# Altium project Elkapod_power_supply.PrjPcb (part 1 of 6)
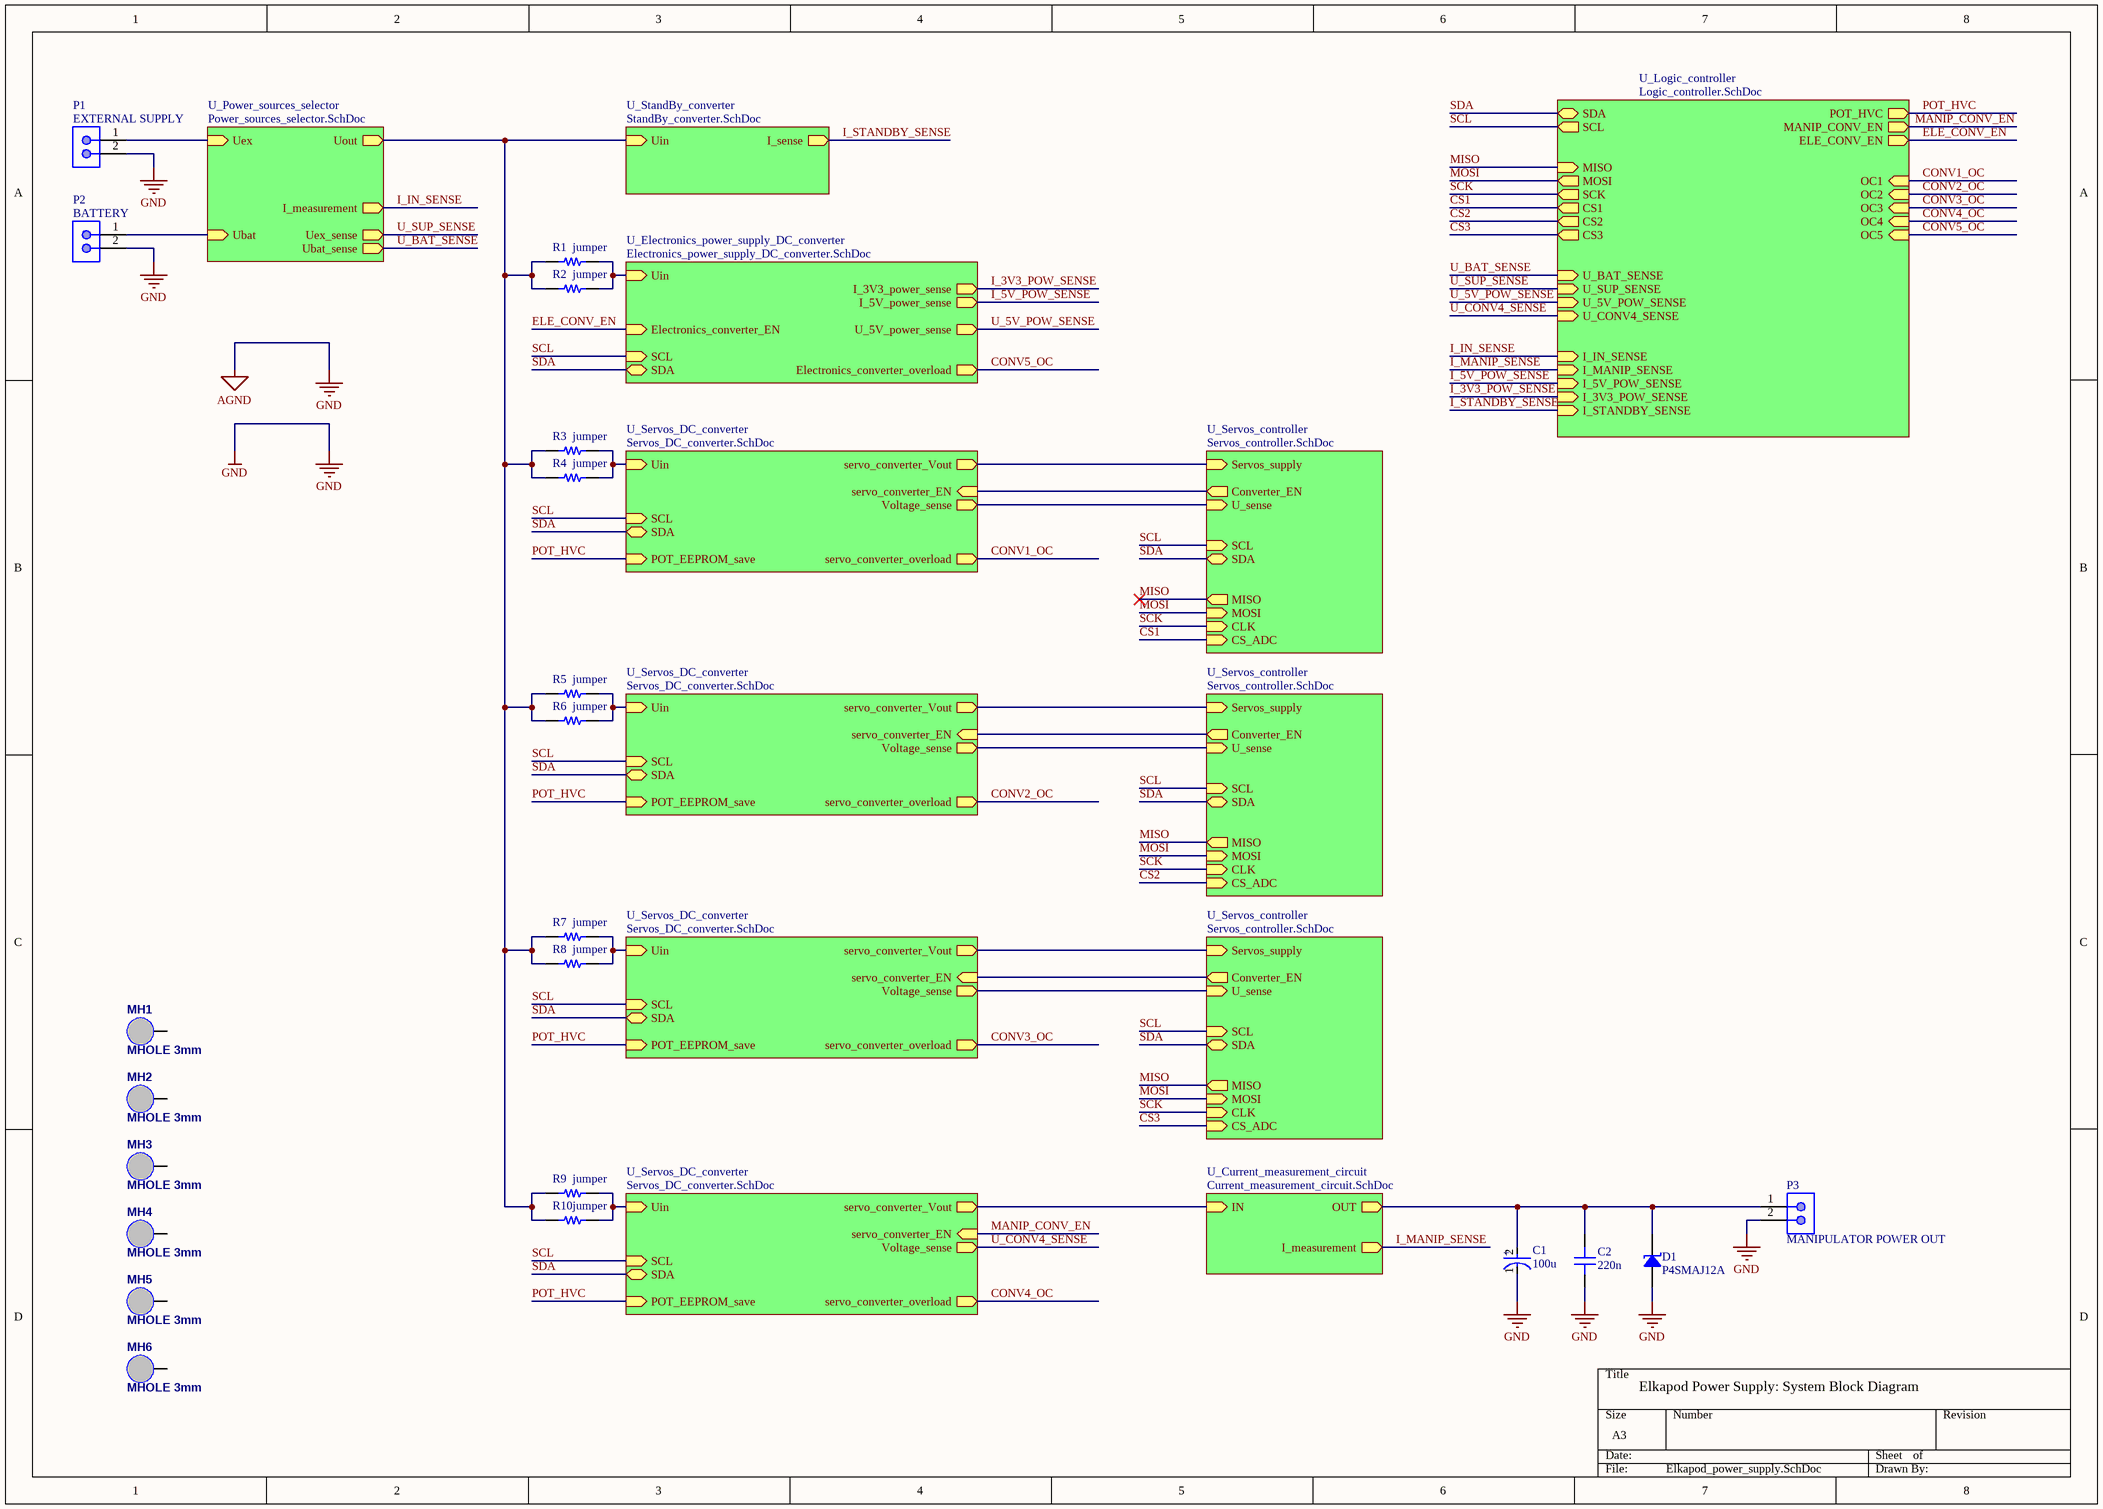
[diagram p0: Elkapod_power_supply.SchDoc]
10 sheets, 1021 parts. Net scope: hierarchical (ports join the sheet entries above them; power ports are global).
Board file: Elkapod_power_supply_PCB.PcbDoc
Sheets:
  Elkapod_power_supply.SchDoc
    U_Power_sources_selector = Power_sources_selector.SchDoc
      U_Current_measurement_circuit = Current_measurement_circuit.SchDoc
    U_StandBy_converter = StandBy_converter.SchDoc
      U_Current_measurement_circuit? = Current_measurement_circuit.SchDoc
    U_Servos_controller = Servos_controller.SchDoc
      U_Servo_control_module? = Servo_control_module.SchDoc
        U_Current_measurement_circuit? = Current_measurement_circuit.SchDoc
      U_Servo_control_module? = Servo_control_module.SchDoc
        U_Current_measurement_circuit? = Current_measurement_circuit.SchDoc
      U_Servo_control_module? = Servo_control_module.SchDoc
        U_Current_measurement_circuit? = Current_measurement_circuit.SchDoc
      U_Servo_control_module? = Servo_control_module.SchDoc
        U_Current_measurement_circuit? = Current_measurement_circuit.SchDoc
      U_Servo_control_module? = Servo_control_module.SchDoc
        U_Current_measurement_circuit? = Current_measurement_circuit.SchDoc
      U_Servo_control_module? = Servo_control_module.SchDoc
        U_Current_measurement_circuit? = Current_measurement_circuit.SchDoc
    U_Servos_DC_converter = Servos_DC_converter.SchDoc
    U_Electronics_power_supply_DC_converter = Electronics_power_supply_DC_converter.SchDoc
      U_Current_measurement_circuit = Current_measurement_circuit.SchDoc
      U_Current_measurement_circuit = Current_measurement_circuit.SchDoc
      U_Controllable_voltage_outputs = Controllable_voltage_outputs.SchDoc
    U_Current_measurement_circuit = Current_measurement_circuit.SchDoc
    U_Servos_controller = Servos_controller.SchDoc
      U_Servo_control_module? = Servo_control_module.SchDoc
        U_Current_measurement_circuit? = Current_measurement_circuit.SchDoc
      U_Servo_control_module? = Servo_control_module.SchDoc
        U_Current_measurement_circuit? = Current_measurement_circuit.SchDoc
      U_Servo_control_module? = Servo_control_module.SchDoc
        U_Current_measurement_circuit? = Current_measurement_circuit.SchDoc
      U_Servo_control_module? = Servo_control_module.SchDoc
        U_Current_measurement_circuit? = Current_measurement_circuit.SchDoc
      U_Servo_control_module? = Servo_control_module.SchDoc
        U_Current_measurement_circuit? = Current_measurement_circuit.SchDoc
      U_Servo_control_module? = Servo_control_module.SchDoc
        U_Current_measurement_circuit? = Current_measurement_circuit.SchDoc
    U_Servos_controller = Servos_controller.SchDoc
      U_Servo_control_module? = Servo_control_module.SchDoc
        U_Current_measurement_circuit? = Current_measurement_circuit.SchDoc
      U_Servo_control_module? = Servo_control_module.SchDoc
        U_Current_measurement_circuit? = Current_measurement_circuit.SchDoc
      U_Servo_control_module? = Servo_control_module.SchDoc
        U_Current_measurement_circuit? = Current_measurement_circuit.SchDoc
      U_Servo_control_module? = Servo_control_module.SchDoc
        U_Current_measurement_circuit? = Current_measurement_circuit.SchDoc
      U_Servo_control_module? = Servo_control_module.SchDoc
        U_Current_measurement_circuit? = Current_measurement_circuit.SchDoc
      U_Servo_control_module? = Servo_control_module.SchDoc
        U_Current_measurement_circuit? = Current_measurement_circuit.SchDoc
    U_Servos_DC_converter = Servos_DC_converter.SchDoc
    U_Servos_DC_converter = Servos_DC_converter.SchDoc
    U_Servos_DC_converter = Servos_DC_converter.SchDoc
    U_Logic_controller = Logic_controller.SchDoc

## Sheet Elkapod_power_supply.SchDoc: Elkapod Power Supply Block Diagram
size A3; SheetNumber: 1; SheetTotal: 10

### Parts
C1  100u  [FP-FKE-MFG]
C2  220n  [CAP 0603_1608]
D1  P4SMAJ12A  [DO214AC SMA]
MH1  MHOLE 3mm  [3mm screw drill III]  (no BOM)
MH2  MHOLE 3mm  [3mm screw drill III]  (no BOM)
MH3  MHOLE 3mm  [3mm screw drill III]  (no BOM)
MH4  MHOLE 3mm  [3mm screw drill III]  (no BOM)
MH5  MHOLE 3mm  [3mm screw drill III]  (no BOM)
MH6  MHOLE 3mm  [3mm screw drill III]  (no BOM)
P1  EXTERNAL SUPPLY  [XT60PW-M]
P2  BATTERY  [XT60PW-M]
P3  MANIPULATOR POWER OUT  [XT60PW-M]
R1  jumper  [STACKPOLE CSM2512]
R2  jumper  [STACKPOLE CSM2512]
R3  jumper  [STACKPOLE CSM2512]
R4  jumper  [STACKPOLE CSM2512]
R5  jumper  [STACKPOLE CSM2512]
R6  jumper  [STACKPOLE CSM2512]
R7  jumper  [STACKPOLE CSM2512]
R8  jumper  [STACKPOLE CSM2512]
R9  jumper  [STACKPOLE CSM2512]
R10  jumper  [STACKPOLE CSM2512]

### Sub-sheets
U_Current_measurement_circuit = Current_measurement_circuit.SchDoc: I_measurement (out), IN (in), OUT (out)  | Rsense_value: 1m
U_Electronics_power_supply_DC_converter = Electronics_power_supply_DC_converter.SchDoc: Uin (in), Electronics_converter_EN (in), Electronics_converter_overload (out), I_3V3_power_sense (out), I_5V_power_sense (out), U_5V_power_sense (out), SCL (in), SDA (bidir)
U_Logic_controller = Logic_controller.SchDoc: POT_HVC (out), MANIP_CONV_EN (out), ELE_CONV_EN (out), MOSI (out), MISO (in), SCK (out), SDA (bidir), SCL (out), I_IN_SENSE (in), I_5V_POW_SENSE (in), I_3V3_POW_SENSE (in), I_MANIP_SENSE (in), I_STANDBY_SENSE (in), U_BAT_SENSE (in), U_SUP_SENSE (in), U_CONV4_SENSE (in), U_5V_POW_SENSE (in), CS3 (out), CS2 (out), CS1 (out), OC1 (in), OC2 (in), OC3 (in), OC4 (in), OC5 (in)
U_Power_sources_selector = Power_sources_selector.SchDoc: Ubat (in), Uout (out), I_measurement (out), Uex (in), Uex_sense (out), Ubat_sense (out)
U_Servos_controller = Servos_controller.SchDoc: CS_ADC (in), Servos_supply (in), Converter_EN (out), U_sense (in), SCL (in), SDA (bidir), MOSI (in), CLK (in), MISO (out)
U_Servos_controller = Servos_controller.SchDoc: CS_ADC (in), Servos_supply (in), Converter_EN (out), U_sense (in), SCL (in), SDA (bidir), MOSI (in), CLK (in), MISO (out)
U_Servos_controller = Servos_controller.SchDoc: CS_ADC (in), Servos_supply (in), Converter_EN (out), U_sense (in), SCL (in), SDA (bidir), MOSI (in), CLK (in), MISO (out)
U_Servos_DC_converter = Servos_DC_converter.SchDoc: Uin (in), servo_converter_EN (in), servo_converter_overload (out), servo_converter_Vout (out), POT_EEPROM_save (in), Voltage_sense (out), SDA (bidir), SCL (in)  | RF2_value: 2,7k; RF1_value: 1k; RF3_value: 910
U_Servos_DC_converter = Servos_DC_converter.SchDoc: Uin (in), servo_converter_EN (in), servo_converter_overload (out), servo_converter_Vout (out), POT_EEPROM_save (in), Voltage_sense (out), SDA (bidir), SCL (in)  | RF2_value: 2,7k; RF1_value: 1k; RF3_value: 910
U_Servos_DC_converter = Servos_DC_converter.SchDoc: Uin (in), servo_converter_EN (in), servo_converter_overload (out), servo_converter_Vout (out), POT_EEPROM_save (in), Voltage_sense (out), SDA (bidir), SCL (in)  | RF2_value: 2,7k; RF1_value: 1k; RF3_value: 910
U_Servos_DC_converter = Servos_DC_converter.SchDoc: Uin (in), servo_converter_EN (in), servo_converter_overload (out), servo_converter_Vout (out), POT_EEPROM_save (in), Voltage_sense (out), SDA (bidir), SCL (in)  | RF2_value: 2,7k; RF1_value: 1k; RF3_value: 910
U_StandBy_converter = StandBy_converter.SchDoc: Uin (in), I_sense (out)

### Nets
AGND: C1.1(C) C2.2 D1.1 P1.2(-) P2.2(-) P3.2(-)  [also labelled GND]
CONV1_OC: sheet U_Servos_DC_converter/servo_converter_overload, sheet U_Logic_controller/OC1
CONV2_OC: sheet U_Servos_DC_converter/servo_converter_overload, sheet U_Logic_controller/OC2
CONV3_OC: sheet U_Servos_DC_converter/servo_converter_overload, sheet U_Logic_controller/OC3
CONV4_OC: sheet U_Servos_DC_converter/servo_converter_overload, sheet U_Logic_controller/OC4
CONV5_OC: sheet U_Electronics_power_supply_DC_converter/Electronics_converter_overload, sheet U_Logic_controller/OC5
CS1: sheet U_Servos_controller/CS_ADC, sheet U_Logic_controller/CS1
CS2: sheet U_Servos_controller/CS_ADC, sheet U_Logic_controller/CS2
CS3: sheet U_Servos_controller/CS_ADC, sheet U_Logic_controller/CS3
ELE_CONV_EN: sheet U_Electronics_power_supply_DC_converter/Electronics_converter_EN, sheet U_Logic_controller/ELE_CONV_EN
I_3V3_POW_SENSE: sheet U_Electronics_power_supply_DC_converter/I_3V3_power_sense, sheet U_Logic_controller/I_3V3_POW_SENSE
I_5V_POW_SENSE: sheet U_Electronics_power_supply_DC_converter/I_5V_power_sense, sheet U_Logic_controller/I_5V_POW_SENSE
I_IN_SENSE: sheet U_Power_sources_selector/I_measurement, sheet U_Logic_controller/I_IN_SENSE
I_MANIP_SENSE: sheet U_Current_measurement_circuit/I_measurement, sheet U_Logic_controller/I_MANIP_SENSE
I_STANDBY_SENSE: sheet U_StandBy_converter/I_sense, sheet U_Logic_controller/I_STANDBY_SENSE
MANIP_CONV_EN: sheet U_Servos_DC_converter/servo_converter_EN, sheet U_Logic_controller/MANIP_CONV_EN
MISO: sheet U_Servos_controller/MISO, sheet U_Servos_controller/MISO, sheet U_Servos_controller/MISO, sheet U_Logic_controller/MISO
MOSI: sheet U_Servos_controller/MOSI, sheet U_Servos_controller/MOSI, sheet U_Servos_controller/MOSI, sheet U_Logic_controller/MOSI
POT_HVC: sheet U_Servos_DC_converter/POT_EEPROM_save, sheet U_Servos_DC_converter/POT_EEPROM_save, sheet U_Servos_DC_converter/POT_EEPROM_save, sheet U_Servos_DC_converter/POT_EEPROM_save, sheet U_Logic_controller/POT_HVC
SCK: sheet U_Servos_controller/CLK, sheet U_Servos_controller/CLK, sheet U_Servos_controller/CLK, sheet U_Logic_controller/SCK
SCL: sheet U_Servos_controller/SCL, sheet U_Servos_DC_converter/SCL, sheet U_Electronics_power_supply_DC_converter/SCL, sheet U_Servos_controller/SCL, sheet U_Servos_controller/SCL, sheet U_Servos_DC_converter/SCL, sheet U_Servos_DC_converter/SCL, sheet U_Servos_DC_converter/SCL, sheet U_Logic_controller/SCL
SDA: sheet U_Servos_controller/SDA, sheet U_Servos_DC_converter/SDA, sheet U_Electronics_power_supply_DC_converter/SDA, sheet U_Servos_controller/SDA, sheet U_Servos_controller/SDA, sheet U_Servos_DC_converter/SDA, sheet U_Servos_DC_converter/SDA, sheet U_Servos_DC_converter/SDA, sheet U_Logic_controller/SDA
servo_converter_Vout: sheet U_Servos_controller/Servos_supply, sheet U_Servos_DC_converter/servo_converter_Vout
servo_converter_Vout: sheet U_Current_measurement_circuit/IN, sheet U_Servos_DC_converter/servo_converter_Vout  [a separate net that carries the same name]
servo_converter_Vout: sheet U_Servos_controller/Servos_supply, sheet U_Servos_DC_converter/servo_converter_Vout  [a separate net that carries the same name]
servo_converter_Vout: sheet U_Servos_controller/Servos_supply, sheet U_Servos_DC_converter/servo_converter_Vout  [a separate net that carries the same name]
U_5V_POW_SENSE: sheet U_Electronics_power_supply_DC_converter/U_5V_power_sense, sheet U_Logic_controller/U_5V_POW_SENSE
U_BAT_SENSE: sheet U_Power_sources_selector/Ubat_sense, sheet U_Logic_controller/U_BAT_SENSE
U_CONV4_SENSE: sheet U_Servos_DC_converter/Voltage_sense, sheet U_Logic_controller/U_CONV4_SENSE
U_sup: R1.2 R2.2 R3.2 R4.2 R5.2 R6.2 R7.2 R8.2 R9.2 R10.2 ; sheet U_Power_sources_selector/Uout, sheet U_StandBy_converter/Uin
U_SUP_SENSE: sheet U_Power_sources_selector/Uex_sense, sheet U_Logic_controller/U_SUP_SENSE
Uin: R1.1 R2.1 ; sheet U_Electronics_power_supply_DC_converter/Uin
Uin: R3.1 R4.1 ; sheet U_Servos_DC_converter/Uin  [a separate net that carries the same name]
Uin: R5.1 R6.1 ; sheet U_Servos_DC_converter/Uin  [a separate net that carries the same name]
Uin: R7.1 R8.1 ; sheet U_Servos_DC_converter/Uin  [a separate net that carries the same name]
Uin: R9.1 R10.1 ; sheet U_Servos_DC_converter/Uin  [a separate net that carries the same name]
NetC1_2: C1.2(A) C2.1 D1.2 P3.1(+) ; sheet U_Current_measurement_circuit/OUT
NetC72_1#2_2: sheet U_Servos_controller/U_sense, sheet U_Servos_DC_converter/Voltage_sense
NetC72_2#2_2: sheet U_Servos_controller/U_sense, sheet U_Servos_DC_converter/Voltage_sense
NetC72_3#2_2: sheet U_Servos_controller/U_sense, sheet U_Servos_DC_converter/Voltage_sense
NetF1_1: P1.1(+) ; sheet U_Power_sources_selector/Uex
NetF2_1: P2.1(+) ; sheet U_Power_sources_selector/Ubat
NetR39_1_1: sheet U_Servos_controller/Converter_EN, sheet U_Servos_DC_converter/servo_converter_EN
NetR39_2_1: sheet U_Servos_controller/Converter_EN, sheet U_Servos_DC_converter/servo_converter_EN
NetR39_3_1: sheet U_Servos_controller/Converter_EN, sheet U_Servos_DC_converter/servo_converter_EN

Not connected (* = marked no-connect by the designer): MH1 1(GND); MH2 1(GND); MH3 1(GND); MH4 1(GND); MH5 1(GND); MH6 1(GND)

### Notes on the sheet
- Elkapod Power Supply: System Block Diagram
- (in symbol CMP-2000-06205-2) +

### Library data of the parts
C1 = CMP-2000-06205-2: CAP ALUM 100UF 20% 25V SMD; Ripple Current (AC): 300mA; Leakage Current: 3uA; Dielectric Material: Aluminium; Impedance: 260mR; Life (Hours): 2000Hour; Max Operating Temperature: 105°C; Voltage Rating (DC): 25V; Packaging: Tape and Reel; Min Operating Temperature: -55°C; Capacitance: 100uF; Ripple Current: 300mA; Mount: Surface Mount; Lead Free: Lead Free; Construction: Cylindrical; Voltage Rating: 25V; RoHS Compliant: Yes; Case/Package: Radial; Height: 6.2mm; Tolerance: 20%; Diameter: 8mm; Termination: SMD/SMT; Package Quantity: 1; Width: 8.3mm; REACH SVHC: No SVHC; Series: FK; Number of Pins: 2; Voltage: 25V; Radiation Hardening: No; Height - Seated (Max): 0.244inch; Length: 6.2mm; ESR (Equivalent Series Resistance): 260mR
C2 = C0603C272F3GAC7867: CAP CER 220nF 25V X5R 0603; manufacturer: KEMET; Temperature Coefficient: C0G, NP0; Tolerance: ±1%; Part Number: C0603C272F3GAC7867; Value: 220n; Applications: General Purpose; Capacitance: 220n; componentlink1description: Datasheet; componentlink1url: https://api.kemet.com/component-edge/download/datasheet/C0603C272F3GACTU.pdf; componentlink2description: DigiKey Link; componentlink2url: https://www.digikey.com/en/products/detail/kemet/C0603C272F3GAC7867/2200413; Device Package: 0603 (1608 Metric); Features: Low ESL; lastupdated: 09.02.2024 20:10:30; Lifecycle Status: Active; Minimum Order: 1; Mounting Type: Surface Mount, MLCC; Operating Temperature: -55°C ~ 125°C; Package / Case: 0603 (1608 Metric); packaging: TapeAndReel; partid: 2138; Part Status: Active; price: 0.40; series: SMD Comm C0G; Size / Dimension: 0.063" L x 0.031" W (1.60mm x 0.80mm); Thickness (Max): 0.034" (0.87mm); Voltage - Rated: 25V
D1 = SMA6J18A-TP: TVS DIODE 12VDC DO214AC; Part Number: P4SMAJ9.0A
MH1-MH6 = MHOLE_3MM: 3mm Mounting Hole
P1-P3 = XT60PW-M: XT60PW-M; 30A/500V angled female DC PCB socket (pin1 -> +, pin2 -> -)
R1-R10 = CSM2512FT20L0: RES 0 OHM 1W 2512; manufacturer: Stackpole Electronics Inc; Power (Watts): 3W; Temperature Coefficient: ±50ppm/°C; Tolerance: ±1%; value: 20 mOhms; Part Number: CSM2512FT20L0; componentlink1description: Datasheet; componentlink1url: https://www.seielect.com/Catalog/SEI-CSM.PDF; componentlink2description: DigiKey Link; componentlink2url: https://www.digikey.com/en/products/detail/stackpole-electronics-inc/CSM2512FT20L0/6270239; Composition: Metal Element; Device Package: 2512 (6332 Metric); Features: Current Sense; Height - Seated (Max): 0.035" (0.90mm); lastupdated: 03.06.2024 20:27:03; Lifecycle Status: Active; Minimum Order: 4000; Number of Terminations: 2; Operating Temperature: -55°C ~ 170°C; Package / Case: 2512 (6332 Metric); packaging: TapeAndReel; Part Status: Active; price: 0.19; Resistance: jumper; series: CSM; Size / Dimension: 0.252" L x 0.126" W (6.40mm x 3.20mm); Supplier Device Package: 2512

## Sheet Power_sources_selector.SchDoc
size A4; SheetNumber: 6; SheetTotal: 10
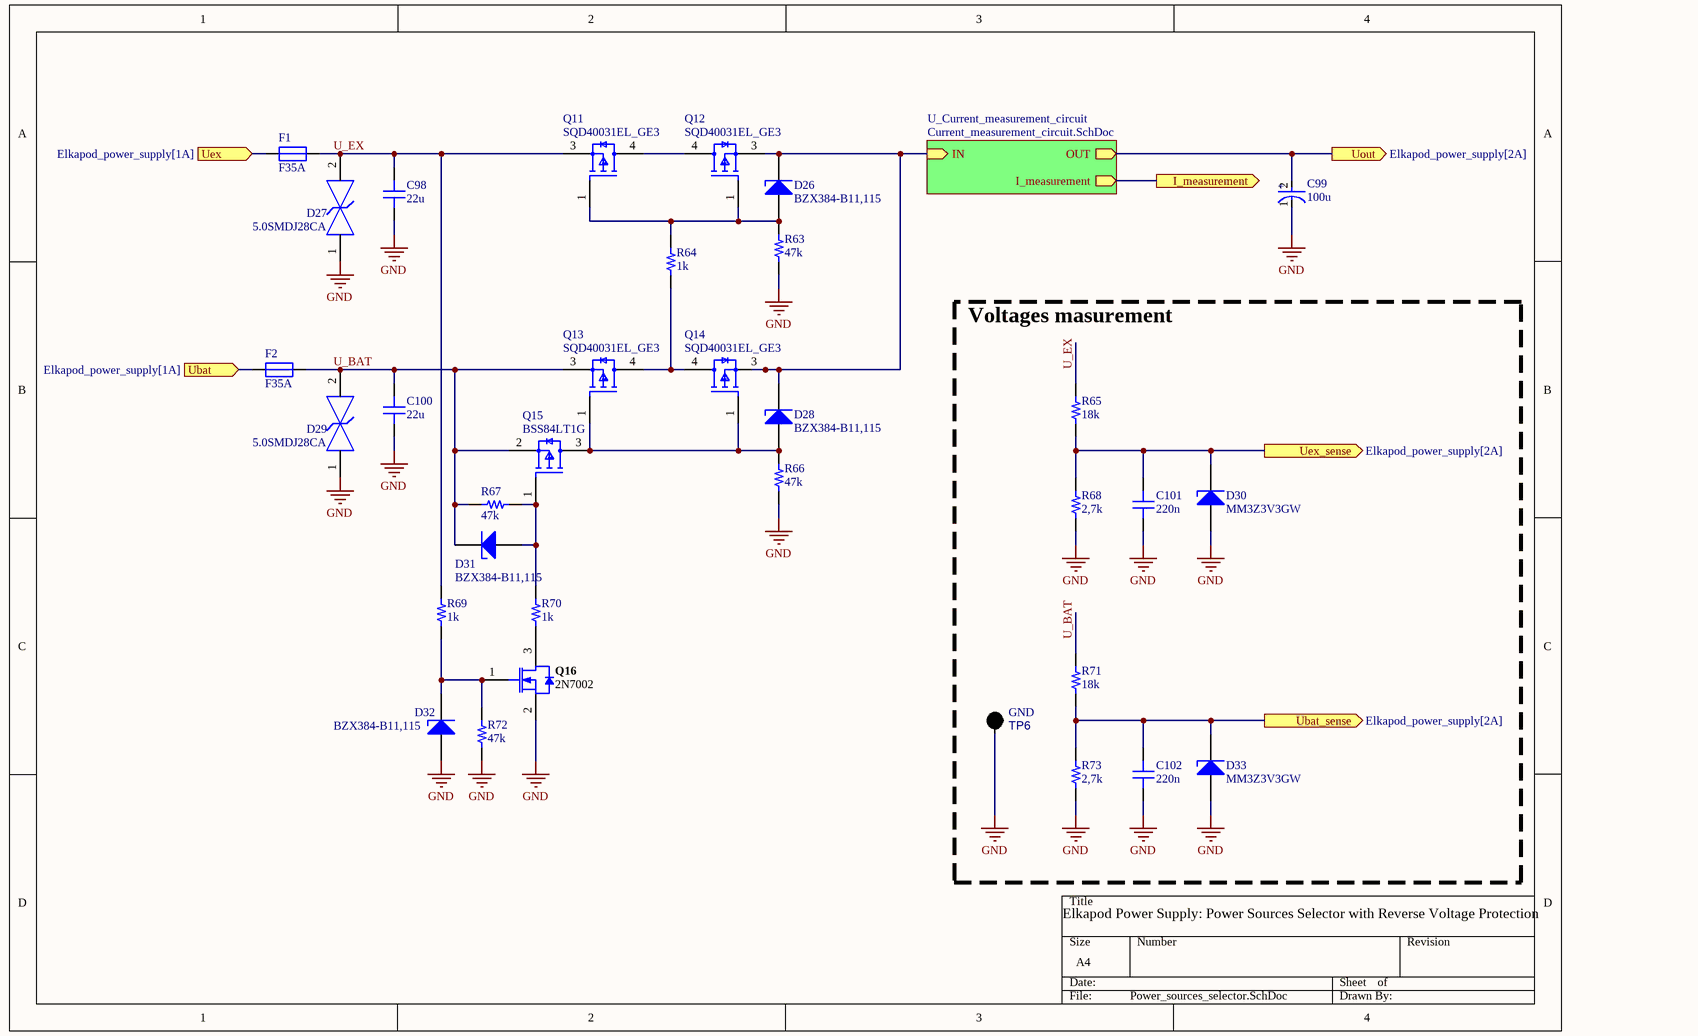
[diagram p1: Power_sources_selector.SchDoc]

### Parts
(Parts that share a designator on the sheet are numbered #1, #2 ... from top to bottom, then left to right.)
C98  22u  [CAP 0805_2012]
C99  100u  [FP-FKE-MFG]
C100  22u  [CAP 0805_2012]
C101#1  220n  [CAP 0603_1608]
C102#1  220n  [CAP 0603_1608]
D26  BZX384-B11,115  [SOD323]
D27  5.0SMDJ28CA  [FP-5_0SMDJ-CA-MFG]
D28  BZX384-B11,115  [SOD323]
D29  5.0SMDJ28CA  [FP-5_0SMDJ-CA-MFG]
D30  MM3Z3V3GW  [SOD323]
D31  BZX384-B11,115  [SOD323]
D32  BZX384-B11,115  [SOD323]
D33  MM3Z3V3GW  [SOD323]
F1  F35A  [6,3x32_fuse_PCB]
F2  F35A  [6,3x32_fuse_PCB]
Q11  SQD40031EL_GE3  [FP-T13-0592-MFG]
Q12  SQD40031EL_GE3  [FP-T13-0592-MFG]
Q13  SQD40031EL_GE3  [FP-T13-0592-MFG]
Q14  SQD40031EL_GE3  [FP-T13-0592-MFG]
Q15  BSS84LT1G  [FP-318-08-IPC_A]
Q16#1  2N7002  [INF-PG-SOT23_M]
R63  47k  [RES 0603_1608]
R64  1k  [RES 0603_1608]
R65  18k  [RES 0603_1608]
R66  47k  [RES 0603_1608]
R67#1  47k  [RES 0603_1608]
R68#1  2,7k  [RES 0603_1608]
R69#1  1k  [RES 0603_1608]
R70#1  1k  [RES 0603_1608]
R71#1  18k  [RES 0603_1608]
R72#1  47k  [RES 0603_1608]
R73#1  2,7k  [RES 0603_1608]
TP6  GND  [Keystone_5006_BLACK]

### Blocks framed on the sheet
Voltages masurement: C101#1 C102#1 D30 D33 R65 R68#1 R71#1 R73#1 TP6

### Sub-sheets
U_Current_measurement_circuit = Current_measurement_circuit.SchDoc: I_measurement (out), IN (in), OUT (out)  | Rsense_value: 0,5m

### Ports
I_measurement (out, see Elkapod_power_supply[2A], Current_measurement_circuit[3B]), Ubat (in, see Elkapod_power_supply[1A]), Ubat_sense (out, see Elkapod_power_supply[2A]), Uex (in, see Elkapod_power_supply[1A]), Uex_sense (out, see Elkapod_power_supply[2A]), Uout (out, see Elkapod_power_supply[2A])

### Nets
GND: C98.1 C99.1(C) C100.1 C101#1.1 C102#1.1 D27.1 D29.1 D30.1(A) D32.1(A) D33.1(A) Q16#1.2(SOURCE) R63.1 R66.1 R68#1.2 R72#1.1 R73#1.2 TP6.0  [project net AGND]
I_IN_SENSE: port I_measurement, sheet U_Current_measurement_circuit/I_measurement
U_BAT: C100.2 D29.2 D31.2(K) F2.2 Q13.3(S) Q15.2(S) R67#1.2 R71#1.1  [project net U_BAT_6]
U_BAT_SENSE: C102#1.2 D33.2(K) R71#1.2 R73#1.1 ; port Ubat_sense
U_EX: C98.2 D27.2 F1.2 Q11.3(S) R65.1 R69#1.2  [project net U_EX_6]
U_sup: C99.2(A) ; port Uout, sheet U_Current_measurement_circuit/OUT
U_SUP_SENSE: C101#1.2 D30.2(K) R65.2 R68#1.1 ; port Uex_sense
NetD26_1: D26.1(A) Q11.1(G) Q12.1(G) R63.2 R64.2
NetD26_2: D26.2(K) D28.2(K) Q12.3(S) Q14.3(S) ; sheet U_Current_measurement_circuit/IN
NetD28_1: D28.1(A) Q13.1(G) Q14.1(G) Q15.3(D) R66.2
NetD31_1: D31.1(A) Q15.1(G) R67#1.1 R70#1.2
NetD32_2: D32.2(K) Q16#1.1(GATE) R69#1.1 R72#1.2
NetF1_1: F1.1 ; port Uex
NetF2_1: F2.1 ; port Ubat
NetQ11_4: Q11.4(D) Q12.4(D)
NetQ13_4: Q13.4(D) Q14.4(D) R64.1
NetQ16#1_3: Q16#1.3(DRAIN) R70#1.1

### Notes on the sheet
- Elkapod Power Supply: Power Sources Selector with Reverse Voltage Protection
- (in symbol CMP-2000-06205-2) +

### Library data of the parts
C98 C100 = VJ0805Y684KXQTW1BC: CAP CER 22UF 25V X7R 0805; manufacturer: Vishay Vitramon; Tolerance: ±10%; Voltage - Rated: 10V; Part Number: VJ0805Y684KXQTW1BC; Value: 22u; Applications: General Purpose; Capacitance: 22u; componentlink1description: Datasheet; componentlink1url: https://www.vishay.com/docs/28548/vjw1bcbascomseries.pdf; componentlink2description: DigiKey Link; componentlink2url: https://www.digikey.com/en/products/detail/vishay-vitramon/VJ0805Y684KXQTW1BC/8313569; Device Package: 0805 (2012 Metric); lastupdated: 09.02.2024 20:13:13; Lifecycle Status: Active; Minimum Order: 1; Mounting Type: Surface Mount, MLCC; Operating Temperature: -55°C ~ 125°C; Package / Case: 0805 (2012 Metric); packaging: TapeAndReel; partid: 57262; price: 0.05; series: VJ W1BC; Size / Dimension: 0.079" L x 0.049" W (2.00mm x 1.25mm); Temperature Coefficient: X7R; Thickness (Max): 0.053" (1.35mm)
C99 = CMP-2000-06205-2: as C1 on sheet Elkapod_power_supply; Max Operating Temperature: 105°C; Voltage Rating (DC): 25V; Packaging: Tape and Reel; Min Operating Temperature: -55°C; Capacitance: 100uF; Ripple Current: 300mA; Mount: Surface Mount; Lead Free: Lead Free; Construction: Cylindrical; Voltage Rating: 25V; RoHS Compliant: Yes; Case/Package: Radial; Height: 6.2mm; Tolerance: 20%; Diameter: 8mm; Termination: SMD/SMT; Package Quantity: 1; Width: 8.3mm; REACH SVHC: No SVHC; Series: FK; Number of Pins: 2; Voltage: 25V; Radiation Hardening: No; Height - Seated (Max): 0.244inch; Length: 6.2mm; ESR (Equivalent Series Resistance): 260mR
C101#1 C102#1 = C0603C272F3GAC7867: as C2 on sheet Elkapod_power_supply; Part Number: C0603C272F3GAC7867; Value: 220n; Applications: General Purpose; Capacitance: 220n; componentlink1description: Datasheet; componentlink1url: https://api.kemet.com/component-edge/download/datasheet/C0603C272F3GACTU.pdf; componentlink2description: DigiKey Link; componentlink2url: https://www.digikey.com/en/products/detail/kemet/C0603C272F3GAC7867/2200413; Device Package: 0603 (1608 Metric); Features: Low ESL; lastupdated: 09.02.2024 20:10:30; Lifecycle Status: Active; Minimum Order: 1; Mounting Type: Surface Mount, MLCC; Operating Temperature: -55°C ~ 125°C; Package / Case: 0603 (1608 Metric); packaging: TapeAndReel; partid: 2138; Part Status: Active; price: 0.40; series: SMD Comm C0G; Size / Dimension: 0.063" L x 0.031" W (1.60mm x 0.80mm); Thickness (Max): 0.034" (0.87mm); Voltage - Rated: 25V
D26 D28 D31 D32 = Zener_Diode_SOD323: 11V, 0,3W Zener diode
D27 D29 = CMP-08607-000055-1: TVS DIODE 28V 45.4V DO214AB; Manufacturer: Littelfuse Inc; Breakdown Voltage: 31.1V; Peak Pulse Current: 110A; Number Of Channels: 1; Direction: Bidirectional; Max Junction Temp: +150°C; Peak Pulse Power: 5000W; Device Class L1: Circuit Protection; Manufacturer Part Number: 5.0SMDJ28CA; Package: 5.0SMDJ-CA; Mouser Description: 5.0SMDJ Series 31.1 V 5 kW Surface Mount Bi-Directional TVS Diode - DO-214AB; Category: Diode; Digikey Description: TVS DIODE 28V 45.4V DO214AB; Temperature Range Low: -65°C; Device Class L2: TVS Diodes; Temperature: -65°C to +150°C; ComponentLink2Description: Datasheet; RoHS: TRUE; Temperature Range High: +150°C; Automotive: No; Lead Free: Yes; Reverse Standoff Voltage: 28V; Device Class L3: unset; Height: 2.62mm; Octopart: https://octopart.com/5.0smdj28ca-littelfuse-12584638; ComponentLink2URL: https://www.littelfuse.com/~/media/electronics/datasheets/tvs_diodes/littelfuse_tvs_diode_5_0smdj_datasheet.pdf.pdf; Clamping Voltage: 45.4V
D30 D33 = Zener_Diode_SOD323: 3,3V, 0,3W Zener diode; SOD323
F1 F2 = 6,3x32_FUSE
Q11-Q14 = CMP-00030-91482453-1: SQD40031EL_GE3 Transistor MOSFET P-CH 30V 100A 3-Pin TO-252; Max Junction Temperature (Tj): 175°C; Continuous Drain Current (ID): -100A; Drain to Source Resistance: 2.63mΩ; Turn-On Delay Time: 16ns; Drain to Source Voltage (Vdss): -30V; Turn-Off Delay Time: 126ns; Power Dissipation: 136W; Gate to Source Voltage (Vgs): 20V; Number of Channels: 1; RoHS: Non-Compliant; NexarPartId: 91482453; Max Operating Temperature: 175°C; Drain to Source Breakdown Voltage: -30V; Height: 2.507mm; Min Operating Temperature: -55°C
Q15 = CMP-1058-00762-2: MOSFET P-CH 50V 130MA SOT-23; Max Power Dissipation: 225mW; On-State Resistance: 10R; Nominal Vgs: 2V; Gate to Source Voltage (Vgs): 20V; Rise Time: 1ns; Turn-Off Delay Time: 16ns; Voltage Rating (DC): -50V; Turn-On Delay Time: 3.6ns; Number of Elements: 1; Current Rating: -130mA; Input Capacitance: 30pF; Threshold Voltage: -2V; Element Configuration: Single; Drain to Source Breakdown Voltage: 50V; Continuous Drain Current (ID): 130mA; Length: 0.119inch; Drain to Source Voltage (Vdss): 50V; Min Operating Temperature: -55°C; Contact Plating: Tin; Lead Free: Lead Free; Width: 0.055inch; Case/Package: SOT-23-3; Max Operating Temperature: 150°C; Halogen Free: Halogen Free; Radiation Hardening: No; Drain to Source Resistance: 10R; REACH SVHC: No SVHC; Power Dissipation: 225mW; Number of Pins: 3; Package Quantity: 1; Packaging: Tape and Reel; Fall Time: 1ns; Rds On Max: 10R; Height: 0.04inch
Q16#1 = CMP-1149-00026-1: N-Channel OptiMOS Small-Signal-Transistor, 60 V VDS, 0.3 A ID, -55 to 150 degC, PG-SOT23, Reel, Green; Manufacturer: Infineon; RDS (on) (max) (@4.5V): 4,000 mOhm; VDS (max): 60 V; IDpuls (max): 1.2Â A; QG: 0.4Â nC; RDS (on) (max): 3,000 mOhm; RthJA (max): 250 K/W; ID (max): 0.3Â A; VGS(th) (max): 2.5Â V; VGS(th) (min): 1.5Â V; Green: TRUE; Ptot (max): 0.5Â W; PackageDescription: 3-Pin Small Outline Transistor Package, 2.9 x 1.3 mm Body, 0.95 mm Pitch; Halogen-free: TRUE; ComponentLink2Description: Datasheet; ComponentLink1URL: http://www.infineon.com/; Packing: Reel; DatasheetVersion: Rev. 2.4; PartNumber: 2N7002; PackageReference: PG-SOT23; PackageVersion: Apr-08; ComponentLink3URL: http://www.infineon.com/dgdl/SOT23-Package_Overview.pdf?folderId=db3a30431936bc4b0119532290053c66&fileId=db3a30431936bc4b0119533468123c85; ComponentLink1Description: Manufacturer URL; Mounting Technology: Surface Mount; ComponentLink3Description: Package Specification; ComponentLink2URL: http://www.infineon.com/dgdl/2N7002_Rev2.4.pdf?folderId=db3a3043156fd573011622e10b5c1f67&fileId=db3a304319bc939a0119c2a9461e79e6
R63 R66 R67#1 R72#1 = RNCS0603BKE10K0: RES 47K OHM 1% 0,1W 0603; Manufacturer: Stackpole Electronics Inc; Power (Watts): 0.063W, 1/16W; Temperature Coefficient: ±25ppm/°C; Tolerance: ±0.1%; Part Number: RNCS0603BKE10K0; Value: 47k; Composition: Thin Film; Device Package: 0603 (1608 Metric); Features: Anti-Corrosive, Automotive AEC-Q200, Moisture Resistant; Height - Seated (Max): 0.022" (0.55mm); LastUpdated: 09.02.2024 20:43:37; Lifecycle Status: Active; Minimum Order: 1; Number of Terminations: 2; Operating Temperature: -55°C ~ 155°C; Package / Case: 0603 (1608 Metric); Packaging: TapeAndReel; PartId: 4838; Part Status: Active; Price: 0.06; Ratings: AEC-Q200; Resistance: 47k; Series: RNCS; Size / Dimension: 0.061" L x 0.031" W (1.55mm x 0.80mm); Supplier Device Package: 0603
R64 R69#1 R70#1 = RNCS0603BKE10K0: RES 1K OHM 1% 0,1W 0603; Manufacturer: Stackpole Electronics Inc; Power (Watts): 0.063W, 1/16W; Temperature Coefficient: ±25ppm/°C; Tolerance: ±0.1%; Part Number: RNCS0603BKE10K0; Value: 1k; Composition: Thin Film; Device Package: 0603 (1608 Metric); Features: Anti-Corrosive, Automotive AEC-Q200, Moisture Resistant; Height - Seated (Max): 0.022" (0.55mm); LastUpdated: 09.02.2024 20:43:37; Lifecycle Status: Active; Minimum Order: 1; Number of Terminations: 2; Operating Temperature: -55°C ~ 155°C; Package / Case: 0603 (1608 Metric); Packaging: TapeAndReel; PartId: 4838; Part Status: Active; Price: 0.06; Ratings: AEC-Q200; Resistance: 1k; Series: RNCS; Size / Dimension: 0.061" L x 0.031" W (1.55mm x 0.80mm); Supplier Device Package: 0603
R65 R71#1 = RNCS0603BKE10K0: RES 18K OHM 1% 0,1W 0603; Manufacturer: Stackpole Electronics Inc; Power (Watts): 0.063W, 1/16W; Temperature Coefficient: ±25ppm/°C; Tolerance: ±0.1%; Part Number: RNCS0603BKE10K0; Value: 18k; Composition: Thin Film; Device Package: 0603 (1608 Metric); Features: Anti-Corrosive, Automotive AEC-Q200, Moisture Resistant; Height - Seated (Max): 0.022" (0.55mm); LastUpdated: 09.02.2024 20:43:37; Lifecycle Status: Active; Minimum Order: 1; Number of Terminations: 2; Operating Temperature: -55°C ~ 155°C; Package / Case: 0603 (1608 Metric); Packaging: TapeAndReel; PartId: 4838; Part Status: Active; Price: 0.06; Ratings: AEC-Q200; Resistance: 18k; Series: RNCS; Size / Dimension: 0.061" L x 0.031" W (1.55mm x 0.80mm); Supplier Device Package: 0603
R68#1 R73#1 = RNCS0603BKE10K0: RES 2,7K OHM 1% 0,1W 0603; Manufacturer: Stackpole Electronics Inc; Power (Watts): 0.063W, 1/16W; Temperature Coefficient: ±25ppm/°C; Tolerance: ±0.1%; Part Number: RNCS0603BKE10K0; Value: 2,7k; Composition: Thin Film; Device Package: 0603 (1608 Metric); Features: Anti-Corrosive, Automotive AEC-Q200, Moisture Resistant; Height - Seated (Max): 0.022" (0.55mm); LastUpdated: 09.02.2024 20:43:37; Lifecycle Status: Active; Minimum Order: 1; Number of Terminations: 2; Operating Temperature: -55°C ~ 155°C; Package / Case: 0603 (1608 Metric); Packaging: TapeAndReel; PartId: 4838; Part Status: Active; Price: 0.06; Ratings: AEC-Q200; Resistance: 2,7k; Series: RNCS; Size / Dimension: 0.061" L x 0.031" W (1.55mm x 0.80mm); Supplier Device Package: 0603
TP6 = Keystone 5006 Test Point: Keystone 5006 Test Point (BLACK)

## Sheet Current_measurement_circuit.SchDoc
size A4; SheetNumber: 10; SheetTotal: 10
Used 23 times, as channels U_Power_sources_selector/U_Current_measurement_circuit, U_StandBy_converter/U_Current_measurement_circuit?, U_Servos_controller/U_Servo_control_module?/U_Current_measurement_circuit?, U_Servos_controller/U_Servo_control_module?/U_Current_measurement_circuit?, U_Servos_controller/U_Servo_control_module?/U_Current_measurement_circuit?, U_Servos_controller/U_Servo_control_module?/U_Current_measurement_circuit?, U_Servos_controller/U_Servo_control_module?/U_Current_measurement_circuit?, U_Servos_controller/U_Servo_control_module?/U_Current_measurement_circuit?, U_Electronics_power_supply_DC_converter/U_Current_measurement_circuit, U_Electronics_power_supply_DC_converter/U_Current_measurement_circuit, U_Current_measurement_circuit, U_Servos_controller/U_Servo_control_module?/U_Current_measurement_circuit?, U_Servos_controller/U_Servo_control_module?/U_Current_measurement_circuit?, U_Servos_controller/U_Servo_control_module?/U_Current_measurement_circuit?, U_Servos_controller/U_Servo_control_module?/U_Current_measurement_circuit?, U_Servos_controller/U_Servo_control_module?/U_Current_measurement_circuit?, U_Servos_controller/U_Servo_control_module?/U_Current_measurement_circuit?, U_Servos_controller/U_Servo_control_module?/U_Current_measurement_circuit?, U_Servos_controller/U_Servo_control_module?/U_Current_measurement_circuit?, U_Servos_controller/U_Servo_control_module?/U_Current_measurement_circuit?, U_Servos_controller/U_Servo_control_module?/U_Current_measurement_circuit?, U_Servos_controller/U_Servo_control_module?/U_Current_measurement_circuit?, U_Servos_controller/U_Servo_control_module?/U_Current_measurement_circuit?. Parts and nets are listed once, with the designators drawn on the sheet.
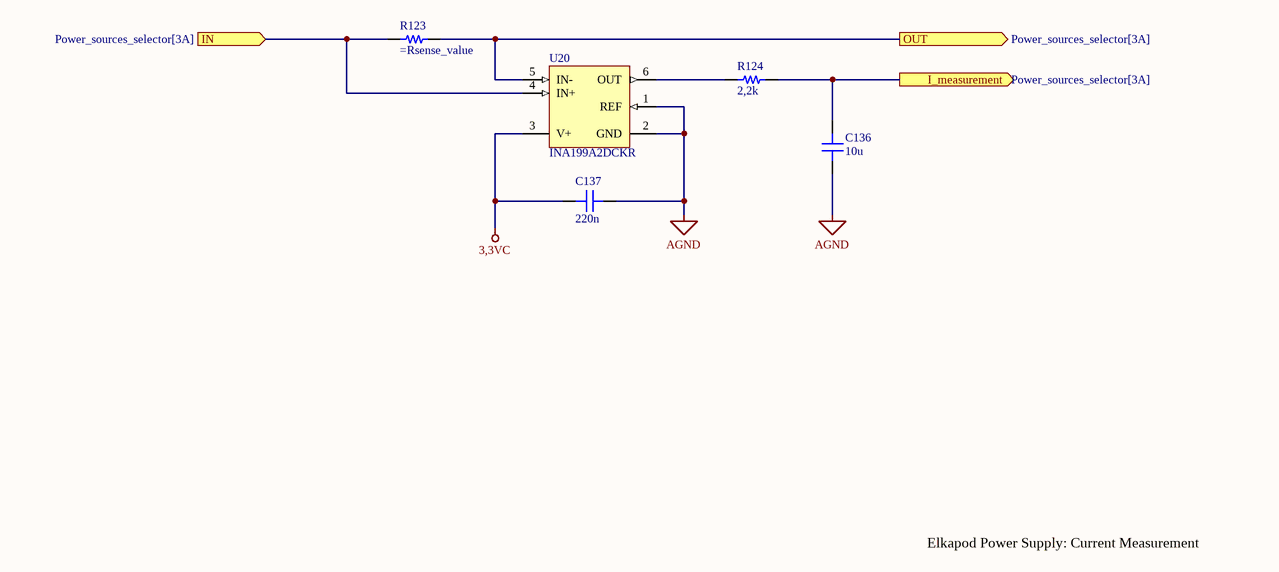
[diagram p2: Current_measurement_circuit.SchDoc]

### Parts
C136  10u  [CAP 0603_1608]
C137  220n  [CAP 0603_1608]
R123  (no value)  [STACKPOLE CSM2512]
R124  2,2k  [RES 0603_1608]
U20  INA199A2DCKR  [DCK0006A_N]

### Ports
I_measurement (out, see Power_sources_selector[3A]), IN (in, see Power_sources_selector[3A]), OUT (out, see Power_sources_selector[3A])

### Nets
3,3VC: C137.2 U20.3(V+)
AGND: C136.1 C137.1 U20.1(REF) U20.2(GND)
I_measurement: C136.2 R124.2 ; port I_measurement
IN: R123.2 U20.4(IN+) ; port IN
OUT: R123.1 U20.5(IN-) ; port OUT
NetR124_1: R124.1 U20.6(OUT)

### Channels
U_Power_sources_selector/U_Current_measurement_circuit: designators end in _1; ports I_measurement=I_IN_SENSE IN=NetD26_2 OUT=U_sup
U_StandBy_converter/U_Current_measurement_circuit?: designators end in _2; ports I_measurement=I_STANDBY_SENSE IN=NetC82_2 OUT=5V_STANDBY
U_Servos_controller/U_Servo_control_module?/U_Current_measurement_circuit?: designators end in _3; ports I_measurement=NetC136_3_2 IN=NetC72_1#1_2 OUT=NetC73_1#1_2
U_Servos_controller/U_Servo_control_module?/U_Current_measurement_circuit?: designators end in _4; ports I_measurement=NetC136_4_2 IN=NetC72_2#1_2 OUT=NetC73_2#1_2
U_Servos_controller/U_Servo_control_module?/U_Current_measurement_circuit?: designators end in _5; ports I_measurement=NetC136_5_2 IN=NetC72_3#1_2 OUT=NetC73_3#1_2
U_Servos_controller/U_Servo_control_module?/U_Current_measurement_circuit?: designators end in _6; ports I_measurement=NetC136_6_2 IN=NetC72_4#1_2 OUT=NetC73_4#1_2
U_Servos_controller/U_Servo_control_module?/U_Current_measurement_circuit?: designators end in _7; ports I_measurement=NetC136_7_2 IN=NetC72_5_2 OUT=NetC73_5_2
U_Servos_controller/U_Servo_control_module?/U_Current_measurement_circuit?: designators end in _8; ports I_measurement=NetC136_8_2 IN=NetC72_6_2 OUT=NetC73_6_2
U_Electronics_power_supply_DC_converter/U_Current_measurement_circuit: designators end in _9; ports I_measurement=I_3V3_POW_SENSE IN=3,3V_Vout_power OUT=NetC30_2
U_Electronics_power_supply_DC_converter/U_Current_measurement_circuit: designators end in _10; ports I_measurement=I_5V_POW_SENSE IN=5V_converter_Vout OUT=U_5V_power
U_Current_measurement_circuit: designators end in _11; ports I_measurement=I_MANIP_SENSE IN=servo_converter_Vout OUT=NetC1_2
U_Servos_controller/U_Servo_control_module?/U_Current_measurement_circuit?: designators end in _12; ports I_measurement=NetC136_12_2 IN=NetC72_7_2 OUT=NetC73_7_2
U_Servos_controller/U_Servo_control_module?/U_Current_measurement_circuit?: designators end in _13; ports I_measurement=NetC136_13_2 IN=NetC72_8_2 OUT=NetC73_8_2
U_Servos_controller/U_Servo_control_module?/U_Current_measurement_circuit?: designators end in _14; ports I_measurement=NetC136_14_2 IN=NetC72_9_2 OUT=NetC73_9_2
U_Servos_controller/U_Servo_control_module?/U_Current_measurement_circuit?: designators end in _15; ports I_measurement=NetC136_15_2 IN=NetC72_10_2 OUT=NetC73_10_2
U_Servos_controller/U_Servo_control_module?/U_Current_measurement_circuit?: designators end in _16; ports I_measurement=NetC136_16_2 IN=NetC72_11_2 OUT=NetC73_11_2
U_Servos_controller/U_Servo_control_module?/U_Current_measurement_circuit?: designators end in _17; ports I_measurement=NetC136_17_2 IN=NetC72_12_2 OUT=NetC73_12_2
U_Servos_controller/U_Servo_control_module?/U_Current_measurement_circuit?: designators end in _18; ports I_measurement=NetC136_18_2 IN=NetC72_13_2 OUT=NetC73_13_2
U_Servos_controller/U_Servo_control_module?/U_Current_measurement_circuit?: designators end in _19; ports I_measurement=NetC136_19_2 IN=NetC72_14_2 OUT=NetC73_14_2
U_Servos_controller/U_Servo_control_module?/U_Current_measurement_circuit?: designators end in _20; ports I_measurement=NetC136_20_2 IN=NetC72_15_2 OUT=NetC73_15_2
U_Servos_controller/U_Servo_control_module?/U_Current_measurement_circuit?: designators end in _21; ports I_measurement=NetC136_21_2 IN=NetC72_16_2 OUT=NetC73_16_2
U_Servos_controller/U_Servo_control_module?/U_Current_measurement_circuit?: designators end in _22; ports I_measurement=NetC136_22_2 IN=NetC72_17_2 OUT=NetC73_17_2
U_Servos_controller/U_Servo_control_module?/U_Current_measurement_circuit?: designators end in _23; ports I_measurement=NetC136_23_2 IN=NetC72_18_2 OUT=NetC73_18_2

### Notes on the sheet
- Elkapod Power Supply: Current Measurement

### Library data of the parts
C136 = C0603C272F3GAC7867: CAP CER 10uF 35V X5R 0603; manufacturer: KEMET; Temperature Coefficient: C0G, NP0; Tolerance: ±1%; Voltage - Rated: 25V; Part Number: C0603C272F3GAC7867; Value: 10u; Applications: General Purpose; Capacitance: 10u; componentlink1description: Datasheet; componentlink1url: https://api.kemet.com/component-edge/download/datasheet/C0603C272F3GACTU.pdf; componentlink2description: DigiKey Link; componentlink2url: https://www.digikey.com/en/products/detail/kemet/C0603C272F3GAC7867/2200413; Device Package: 0603 (1608 Metric); Features: Low ESL; lastupdated: 09.02.2024 20:10:30; Lifecycle Status: Active; Minimum Order: 1; Mounting Type: Surface Mount, MLCC; Operating Temperature: -55°C ~ 125°C; Package / Case: 0603 (1608 Metric); packaging: TapeAndReel; partid: 2138; Part Status: Active; price: 0.40; series: SMD Comm C0G; Size / Dimension: 0.063" L x 0.031" W (1.60mm x 0.80mm); Thickness (Max): 0.034" (0.87mm)
C137 = C0603C272F3GAC7867: as C2 on sheet Elkapod_power_supply; Part Number: C0603C272F3GAC7867; Value: 220n; Applications: General Purpose; Capacitance: 220n; componentlink1description: Datasheet; componentlink1url: https://api.kemet.com/component-edge/download/datasheet/C0603C272F3GACTU.pdf; componentlink2description: DigiKey Link; componentlink2url: https://www.digikey.com/en/products/detail/kemet/C0603C272F3GAC7867/2200413; Device Package: 0603 (1608 Metric); Features: Low ESL; lastupdated: 09.02.2024 20:10:30; Lifecycle Status: Active; Minimum Order: 1; Mounting Type: Surface Mount, MLCC; Operating Temperature: -55°C ~ 125°C; Package / Case: 0603 (1608 Metric); packaging: TapeAndReel; partid: 2138; Part Status: Active; price: 0.40; series: SMD Comm C0G; Size / Dimension: 0.063" L x 0.031" W (1.60mm x 0.80mm); Thickness (Max): 0.034" (0.87mm); Voltage - Rated: 25V
R123 = CSM2512FT20L0: RES 1% 3W 2512; manufacturer: Stackpole Electronics Inc; Temperature Coefficient: ±50ppm/°C; value: 20 mOhms; Part Number: CSM2512FT20L0; componentlink1description: Datasheet; componentlink1url: https://www.seielect.com/Catalog/SEI-CSM.PDF; componentlink2description: DigiKey Link; componentlink2url: https://www.digikey.com/en/products/detail/stackpole-electronics-inc/CSM2512FT20L0/6270239; Composition: Metal Element; Device Package: 2512 (6332 Metric); Features: Current Sense; Height - Seated (Max): 0.035" (0.90mm); lastupdated: 03.06.2024 20:27:03; Lifecycle Status: Active; Minimum Order: 4000; Number of Terminations: 2; Operating Temperature: -55°C ~ 170°C; Package / Case: 2512 (6332 Metric); packaging: TapeAndReel; Part Status: Active; Power (Watts): 3W; price: 0.19; Resistance: =Rsense_value; series: CSM; Size / Dimension: 0.252" L x 0.126" W (6.40mm x 3.20mm); Supplier Device Package: 2512; Tolerance: ±1%
R124 = RNCS0603BKE10K0: RES 2,2K OHM 1% 0,1W 0603; Manufacturer: Stackpole Electronics Inc; Power (Watts): 0.063W, 1/16W; Temperature Coefficient: ±25ppm/°C; Tolerance: ±0.1%; Part Number: RNCS0603BKE10K0; Value: 2,2k; Composition: Thin Film; Device Package: 0603 (1608 Metric); Features: Anti-Corrosive, Automotive AEC-Q200, Moisture Resistant; Height - Seated (Max): 0.022" (0.55mm); LastUpdated: 09.02.2024 20:43:37; Lifecycle Status: Active; Minimum Order: 1; Number of Terminations: 2; Operating Temperature: -55°C ~ 155°C; Package / Case: 0603 (1608 Metric); Packaging: TapeAndReel; PartId: 4838; Part Status: Active; Price: 0.06; Ratings: AEC-Q200; Resistance: 2,2k; Series: RNCS; Size / Dimension: 0.061" L x 0.031" W (1.55mm x 0.80mm); Supplier Device Package: 0603
U20 = CMP-0704-00046-2: Voltage Output, High or Low Side Measurement, Bi-Directional Zero-Drift Series, 2.7 to 26 V, -40 to 125 degC, 6-pin SOT23 (DCK6), Green (RoHS & no Sb/Br); Rating: Catalog; CMRR(Min)(dB): 100; Quiescent Current (+/-)(Typ)(mA): 0.065; Input Offset Drift (+/-)(Max)(uV/Degrees Celsius): 0.5; Vs(Max)(V): 26; SubFamily: Current Shunt Monitor; Small-Signal Bandwidth(Typ)(MHz): 0.03; Vs(Min)(V): 2.7; Input Offset (+/-)(Max)(uV): 150; Common Mode Range(Min)(V): -0.3; PackageVersion: 4093553-4/G, 01/2007; PartNumber: INA199A2DCKR; DatasheetVersion: SBOS469D; ComponentLink2URL: http://www.ti.com/general/docs/lit/getliterature.tsp?genericPartNumber=INA199A2&fileType=pdf; Gain(V/V): 100; ComponentLink1Description: Manufacturer URL; PackageReference: DCK0006A; ComponentLink3Description: Package Specification; ComponentLink1URL: http://www.ti.com/; ComponentLink3URL: http://www.ti.com/lit/ds/symlink/ina212-q1.pdf; ComponentLink2Description: Datasheet; PackageDescription: 6-Pin Plastic Small Outline, Body 2 x 1.25 mm, Pitch 0.65 mm; Common Mode Range(Max)(V): 26; Mounting Technology: Surface Mount; Output Type: Voltage; Code_JEDEC: MO-203; Eco-Plan: Green (RoHS & no Sb/Br)